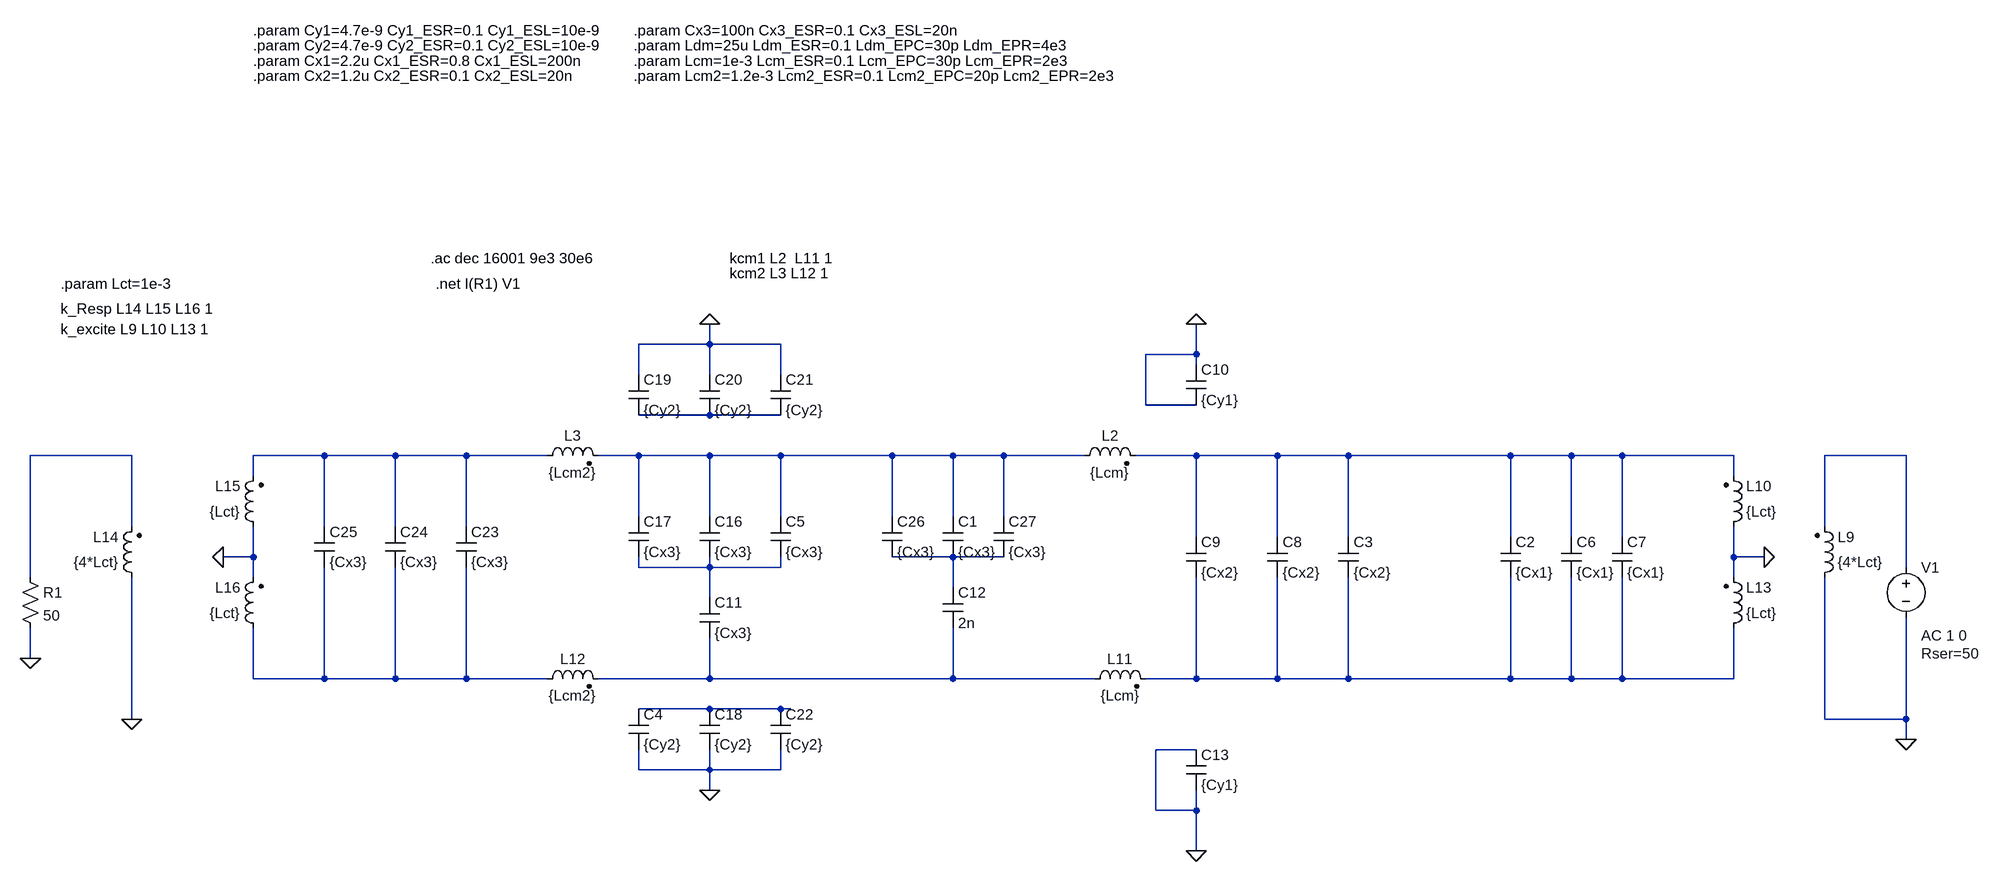
[diagram p0: schematic Simulation_PEF_1phase_DM_No_LDM.asc]
Simulation_PEF_1phase_DM_No_LDM.asc, the LTspice schematic file:
Version 4
SHEET 1 2144 1872
WIRE -496 -192 -496 -224
WIRE -496 -192 -608 -192
WIRE -384 -192 -496 -192
WIRE 272 -176 272 -224
WIRE 272 -176 192 -176
WIRE 272 -160 272 -176
WIRE -608 -144 -608 -192
WIRE -496 -144 -496 -192
WIRE -384 -144 -384 -192
WIRE 192 -96 192 -176
WIRE 272 -96 192 -96
WIRE -496 -80 -608 -80
WIRE -384 -80 -496 -80
WIRE -1408 -16 -1568 -16
WIRE -1104 -16 -1216 -16
WIRE -992 -16 -1104 -16
WIRE -880 -16 -992 -16
WIRE -752 -16 -880 -16
WIRE -608 -16 -672 -16
WIRE -496 -16 -608 -16
WIRE -384 -16 -496 -16
WIRE -208 -16 -384 -16
WIRE -112 -16 -208 -16
WIRE -32 -16 -112 -16
WIRE 96 -16 -32 -16
WIRE 272 -16 176 -16
WIRE 400 -16 272 -16
WIRE 512 -16 400 -16
WIRE 768 -16 512 -16
WIRE 864 -16 768 -16
WIRE 944 -16 864 -16
WIRE 1120 -16 944 -16
WIRE 1392 -16 1264 -16
WIRE -1216 16 -1216 -16
WIRE 1120 16 1120 -16
WIRE -608 80 -608 -16
WIRE -496 80 -496 -16
WIRE -384 80 -384 -16
WIRE -208 80 -208 -16
WIRE -112 80 -112 -16
WIRE -32 80 -32 -16
WIRE -1408 96 -1408 -16
WIRE -1104 96 -1104 -16
WIRE -992 96 -992 -16
WIRE -880 96 -880 -16
WIRE 1264 96 1264 -16
WIRE 272 112 272 -16
WIRE 400 112 400 -16
WIRE 512 112 512 -16
WIRE 768 112 768 -16
WIRE 864 112 864 -16
WIRE 944 112 944 -16
WIRE -1216 144 -1216 96
WIRE -1216 144 -1264 144
WIRE -112 144 -208 144
WIRE -32 144 -112 144
WIRE 1120 144 1120 96
WIRE 1168 144 1120 144
WIRE -608 160 -608 144
WIRE -496 160 -496 144
WIRE -496 160 -608 160
WIRE -384 160 -384 144
WIRE -384 160 -496 160
WIRE 1392 160 1392 -16
WIRE -1568 176 -1568 -16
WIRE -1216 176 -1216 144
WIRE 1120 176 1120 144
WIRE -112 192 -112 144
WIRE -496 208 -496 160
WIRE -1568 304 -1568 256
WIRE -1216 336 -1216 256
WIRE -1104 336 -1104 160
WIRE -1104 336 -1216 336
WIRE -992 336 -992 160
WIRE -992 336 -1104 336
WIRE -880 336 -880 160
WIRE -880 336 -992 336
WIRE -752 336 -880 336
WIRE -496 336 -496 272
WIRE -496 336 -672 336
WIRE -112 336 -112 256
WIRE -112 336 -496 336
WIRE 112 336 -112 336
WIRE 272 336 272 176
WIRE 272 336 192 336
WIRE 400 336 400 176
WIRE 400 336 272 336
WIRE 512 336 512 176
WIRE 512 336 400 336
WIRE 768 336 768 176
WIRE 768 336 512 336
WIRE 864 336 864 176
WIRE 864 336 768 336
WIRE 944 336 944 176
WIRE 944 336 864 336
WIRE 1120 336 1120 256
WIRE 1120 336 944 336
WIRE -496 384 -608 384
WIRE -384 384 -496 384
WIRE -368 384 -384 384
WIRE -1408 400 -1408 176
WIRE 1264 400 1264 176
WIRE 1392 400 1392 240
WIRE 1392 400 1264 400
WIRE 1392 432 1392 400
WIRE 272 448 208 448
WIRE -608 480 -608 448
WIRE -496 480 -496 448
WIRE -496 480 -608 480
WIRE -384 480 -384 448
WIRE -384 480 -496 480
WIRE -496 512 -496 480
WIRE 208 544 208 448
WIRE 272 544 272 512
WIRE 272 544 208 544
WIRE 272 608 272 544
FLAG 272 608 0
FLAG 272 -224 0
FLAG -496 -224 0
FLAG -496 512 0
FLAG -1568 304 0
FLAG 1392 432 0
FLAG 1168 144 0
FLAG -1264 144 0
FLAG -1408 400 0
SYMBOL cap 752 112 R0
SYMATTR InstName C2
SYMATTR Value {Cx1}
SYMATTR SpiceLine Rser={Cx1_ESR} Lser={Cx1_ESL}
SYMBOL cap 496 112 R0
SYMATTR InstName C3
SYMATTR Value {Cx2}
SYMATTR SpiceLine Rser={Cx2_ESR} Lser={Cx2_ESL}
SYMBOL ind2 80 0 R270
WINDOW 0 32 56 VTop 2
WINDOW 3 5 56 VBottom 2
SYMATTR InstName L2
SYMATTR Value {Lcm}
SYMATTR Type ind
SYMATTR SpiceLine Rser={Lcm_ESR} Rpar={Lcm_EPR} Cpar={Lcm_EPC}
SYMBOL ind2 -768 0 R270
WINDOW 0 32 56 VTop 2
WINDOW 3 5 56 VBottom 2
SYMATTR InstName L3
SYMATTR Value {Lcm2}
SYMATTR Type ind
SYMATTR SpiceLine Rser={Lcm2_ESR} Rpar={Lcm2_EPR} Cpar={Lcm2_EPC}
SYMBOL cap -624 384 R0
SYMATTR InstName C4
SYMATTR Value {Cy2}
SYMATTR SpiceLine Rser={Cy2_ESR} Lser={Cy2_ESL}
SYMBOL cap -400 80 R0
SYMATTR InstName C5
SYMATTR Value {Cx3}
SYMATTR SpiceLine Rser={Cx3_ESR} Lser={Cx3_ESL}
SYMBOL cap 848 112 R0
SYMATTR InstName C6
SYMATTR Value {Cx1}
SYMATTR SpiceLine Rser={Cx1_ESR} Lser={Cx1_ESL}
SYMBOL cap 928 112 R0
SYMATTR InstName C7
SYMATTR Value {Cx1}
SYMATTR SpiceLine Rser={Cx1_ESR} Lser={Cx1_ESL}
SYMBOL cap 384 112 R0
SYMATTR InstName C8
SYMATTR Value {Cx2}
SYMATTR SpiceLine Rser={Cx2_ESR} Lser={Cx2_ESL}
SYMBOL cap 256 112 R0
SYMATTR InstName C9
SYMATTR Value {Cx2}
SYMATTR SpiceLine Rser={Cx2_ESR} Lser={Cx2_ESL}
SYMBOL ind2 96 352 R270
WINDOW 0 32 56 VTop 2
WINDOW 3 5 56 VBottom 2
SYMATTR InstName L11
SYMATTR Value {Lcm}
SYMATTR Type ind
SYMATTR SpiceLine Rser={Lcm_ESR} Rpar={Lcm_EPR} Cpar={Lcm_EPC}
SYMBOL cap 256 -160 R0
SYMATTR InstName C10
SYMATTR Value {Cy1}
SYMATTR SpiceLine Rser={Cy1_ESR} Lser={Cy1_ESL}
SYMBOL cap 256 448 R0
SYMATTR InstName C13
SYMATTR Value {Cy1}
SYMATTR SpiceLine Rser={Cy1_ESR} Lser={Cy1_ESL}
SYMBOL cap -512 80 R0
SYMATTR InstName C16
SYMATTR Value {Cx3}
SYMATTR SpiceLine Rser={Cx3_ESR} Lser={Cx3_ESL}
SYMBOL cap -624 80 R0
SYMATTR InstName C17
SYMATTR Value {Cx3}
SYMATTR SpiceLine Rser={Cx3_ESR} Lser={Cx3_ESL}
SYMBOL ind2 -768 352 R270
WINDOW 0 32 56 VTop 2
WINDOW 3 5 56 VBottom 2
SYMATTR InstName L12
SYMATTR Value {Lcm2}
SYMATTR Type ind
SYMATTR SpiceLine Rser={Lcm2_ESR} Rpar={Lcm2_EPR} Cpar={Lcm2_EPC}
SYMBOL cap -512 384 R0
SYMATTR InstName C18
SYMATTR Value {Cy2}
SYMATTR SpiceLine Rser={Cy2_ESR} Lser={Cy2_ESL}
SYMBOL cap -624 -144 R0
SYMATTR InstName C19
SYMATTR Value {Cy2}
SYMATTR SpiceLine Rser={Cy2_ESR} Lser={Cy2_ESL}
SYMBOL cap -512 -144 R0
SYMATTR InstName C20
SYMATTR Value {Cy2}
SYMATTR SpiceLine Rser={Cy2_ESR} Lser={Cy2_ESL}
SYMBOL cap -400 -144 R0
SYMATTR InstName C21
SYMATTR Value {Cy2}
SYMATTR SpiceLine Rser={Cy2_ESR} Lser={Cy2_ESL}
SYMBOL cap -400 384 R0
SYMATTR InstName C22
SYMATTR Value {Cy2}
SYMATTR SpiceLine Rser={Cy2_ESR} Lser={Cy2_ESL}
SYMBOL cap -896 96 R0
SYMATTR InstName C23
SYMATTR Value {Cx3}
SYMATTR SpiceLine Rser={Cx3_ESR} Lser={Cx3_ESL}
SYMBOL cap -1008 96 R0
SYMATTR InstName C24
SYMATTR Value {Cx3}
SYMATTR SpiceLine Rser={Cx3_ESR} Lser={Cx3_ESL}
SYMBOL cap -1120 96 R0
SYMATTR InstName C25
SYMATTR Value {Cx3}
SYMATTR SpiceLine Rser={Cx3_ESR} Lser={Cx3_ESL}
SYMBOL voltage 1392 144 R0
WINDOW 123 24 124 Left 2
WINDOW 39 24 152 Left 2
SYMATTR Value2 AC 1 0
SYMATTR SpiceLine Rser=50
SYMATTR InstName V1
SYMATTR Value ""
SYMBOL res -1584 160 R0
SYMATTR InstName R1
SYMATTR Value 50
SYMBOL cap -224 80 R0
SYMATTR InstName C26
SYMATTR Value {Cx3}
SYMATTR SpiceLine Rser={Cx3_ESR} Lser={Cx3_ESL}
SYMBOL cap -128 80 R0
SYMATTR InstName C1
SYMATTR Value {Cx3}
SYMATTR SpiceLine Rser={Cx3_ESR} Lser={Cx3_ESL}
SYMBOL cap -48 80 R0
SYMATTR InstName C27
SYMATTR Value {Cx3}
SYMATTR SpiceLine Rser={Cx3_ESR} Lser={Cx3_ESL}
SYMBOL ind2 1248 192 M180
WINDOW 0 36 80 Left 2
WINDOW 3 36 40 Left 2
SYMATTR InstName L9
SYMATTR Value {4*Lct}
SYMATTR Type ind
SYMBOL ind2 1104 112 M180
WINDOW 0 36 80 Left 2
WINDOW 3 36 40 Left 2
SYMATTR InstName L10
SYMATTR Value {Lct}
SYMATTR Type ind
SYMBOL ind2 1104 272 M180
WINDOW 0 36 80 Left 2
WINDOW 3 36 40 Left 2
SYMATTR InstName L13
SYMATTR Value {Lct}
SYMATTR Type ind
SYMBOL ind2 -1392 192 R180
WINDOW 0 36 80 Left 2
WINDOW 3 36 40 Left 2
SYMATTR InstName L14
SYMATTR Value {4*Lct}
SYMATTR Type ind
SYMBOL ind2 -1200 112 R180
WINDOW 0 36 80 Left 2
WINDOW 3 36 40 Left 2
SYMATTR InstName L15
SYMATTR Value {Lct}
SYMATTR Type ind
SYMBOL ind2 -1200 272 R180
WINDOW 0 36 80 Left 2
WINDOW 3 36 40 Left 2
SYMATTR InstName L16
SYMATTR Value {Lct}
SYMATTR Type ind
SYMBOL cap -512 208 R0
SYMATTR InstName C11
SYMATTR Value {Cx3}
SYMATTR SpiceLine Rser={Cx3_ESR} Lser={Cx3_ESL}
SYMBOL cap -128 192 R0
SYMATTR InstName C12
SYMATTR Value 2n
SYMATTR SpiceLine Rser=0.1 Lser=20n
TEXT -1216 -664 Left 2 !.param Cy2=4.7e-9 Cy2_ESR=0.1 Cy2_ESL=10e-9
TEXT -1216 -688 Left 2 !.param Cy1=4.7e-9 Cy1_ESR=0.1 Cy1_ESL=10e-9
TEXT -1216 -616 Left 2 !.param Cx2=1.2u Cx2_ESR=0.1 Cx2_ESL=20n
TEXT -616 -688 Left 2 !.param Cx3=100n Cx3_ESR=0.1 Cx3_ESL=20n
TEXT -616 -664 Left 2 !.param Ldm=25u Ldm_ESR=0.1 Ldm_EPC=30p Ldm_EPR=4e3
TEXT -464 -328 Left 2 !kcm1 L2  L11 1
TEXT -464 -304 Left 2 !kcm2 L3 L12 1
TEXT -928 -288 Left 2 !.net I(R1) V1
TEXT -936 -328 Left 2 !.ac dec 16001 9e3 30e6
TEXT -1520 -216 Left 2 !k_excite L9 L10 L13 1
TEXT -1520 -248 Left 2 !k_Resp L14 L15 L16 1
TEXT -616 -616 Left 2 !.param Lcm2=1.2e-3 Lcm2_ESR=0.1 Lcm2_EPC=20p Lcm2_EPR=2e3
TEXT -1520 -288 Left 2 !.param Lct=1e-3
TEXT -1216 -640 Left 2 !.param Cx1=2.2u Cx1_ESR=0.8 Cx1_ESL=200n
TEXT -616 -640 Left 2 !.param Lcm=1e-3 Lcm_ESR=0.1 Lcm_EPC=30p Lcm_EPR=2e3

The netlist it stands for:
* Simulation_PEF_1phase_DM_No_LDM.asc
C2 N005 N011 {Cx1} Rser={Cx1_ESR} Lser={Cx1_ESL}
C3 N005 N011 {Cx2} Rser={Cx2_ESR} Lser={Cx2_ESL}
L2 N004 N005 {Lcm} Rser={Lcm_ESR} Rpar={Lcm_EPR} Cpar={Lcm_EPC}
L3 N003 N004 {Lcm2} Rser={Lcm2_ESR} Rpar={Lcm2_EPR} Cpar={Lcm2_EPC}
C4 N012 0 {Cy2} Rser={Cy2_ESR} Lser={Cy2_ESL}
C5 N004 N008 {Cx3} Rser={Cx3_ESR} Lser={Cx3_ESL}
C6 N005 N011 {Cx1} Rser={Cx1_ESR} Lser={Cx1_ESL}
C7 N005 N011 {Cx1} Rser={Cx1_ESR} Lser={Cx1_ESL}
C8 N005 N011 {Cx2} Rser={Cx2_ESR} Lser={Cx2_ESL}
C9 N005 N011 {Cx2} Rser={Cx2_ESR} Lser={Cx2_ESL}
L11 N010 N011 {Lcm} Rser={Lcm_ESR} Rpar={Lcm_EPR} Cpar={Lcm_EPC}
C10 0 0 {Cy1} Rser={Cy1_ESR} Lser={Cy1_ESL}
C13 0 0 {Cy1} Rser={Cy1_ESR} Lser={Cy1_ESL}
C16 N004 N008 {Cx3} Rser={Cx3_ESR} Lser={Cx3_ESL}
C17 N004 N008 {Cx3} Rser={Cx3_ESR} Lser={Cx3_ESL}
L12 N009 N010 {Lcm2} Rser={Lcm2_ESR} Rpar={Lcm2_EPR} Cpar={Lcm2_EPC}
C18 N012 0 {Cy2} Rser={Cy2_ESR} Lser={Cy2_ESL}
C19 0 N001 {Cy2} Rser={Cy2_ESR} Lser={Cy2_ESL}
C20 0 N001 {Cy2} Rser={Cy2_ESR} Lser={Cy2_ESL}
C21 0 N001 {Cy2} Rser={Cy2_ESR} Lser={Cy2_ESL}
C22 N012 0 {Cy2} Rser={Cy2_ESR} Lser={Cy2_ESL}
C23 N003 N009 {Cx3} Rser={Cx3_ESR} Lser={Cx3_ESL}
C24 N003 N009 {Cx3} Rser={Cx3_ESR} Lser={Cx3_ESL}
C25 N003 N009 {Cx3} Rser={Cx3_ESR} Lser={Cx3_ESL}
V1 N006 0 AC 1 0 Rser=50
R1 N002 0 50
C26 N004 N007 {Cx3} Rser={Cx3_ESR} Lser={Cx3_ESL}
C1 N004 N007 {Cx3} Rser={Cx3_ESR} Lser={Cx3_ESL}
C27 N004 N007 {Cx3} Rser={Cx3_ESR} Lser={Cx3_ESL}
L9 0 N006 {4*Lct}
L10 0 N005 {Lct}
L13 N011 0 {Lct}
L14 0 N002 {4*Lct}
L15 0 N003 {Lct}
L16 N009 0 {Lct}
C11 N008 N010 {Cx3} Rser={Cx3_ESR} Lser={Cx3_ESL}
C12 N007 N010 2n Rser=0.1 Lser=20n
.param Cy2=4.7e-9 Cy2_ESR=0.1 Cy2_ESL=10e-9
.param Cy1=4.7e-9 Cy1_ESR=0.1 Cy1_ESL=10e-9
.param Cx2=1.2u Cx2_ESR=0.1 Cx2_ESL=20n
.param Cx3=100n Cx3_ESR=0.1 Cx3_ESL=20n
.param Ldm=25u Ldm_ESR=0.1 Ldm_EPC=30p Ldm_EPR=4e3
kcm1 L2  L11 1
kcm2 L3 L12 1
.net I(R1) V1
.ac dec 16001 9e3 30e6
k_excite L9 L10 L13 1
k_Resp L14 L15 L16 1
.param Lcm2=1.2e-3 Lcm2_ESR=0.1 Lcm2_EPC=20p Lcm2_EPR=2e3
.param Lct=1e-3
.param Cx1=2.2u Cx1_ESR=0.8 Cx1_ESL=200n
.param Lcm=1e-3 Lcm_ESR=0.1 Lcm_EPC=30p Lcm_EPR=2e3
.backanno
.end